# EasyEDA schematic SCH_Nano-2-3s-AM32-ESC_2026-05-21.json
TITLE: Sheet_1; REV: 1.0; Date: 2026-04-12; Sheet: 1/1; Drawn By: minhaz_islam_nafi; Company: Your Company
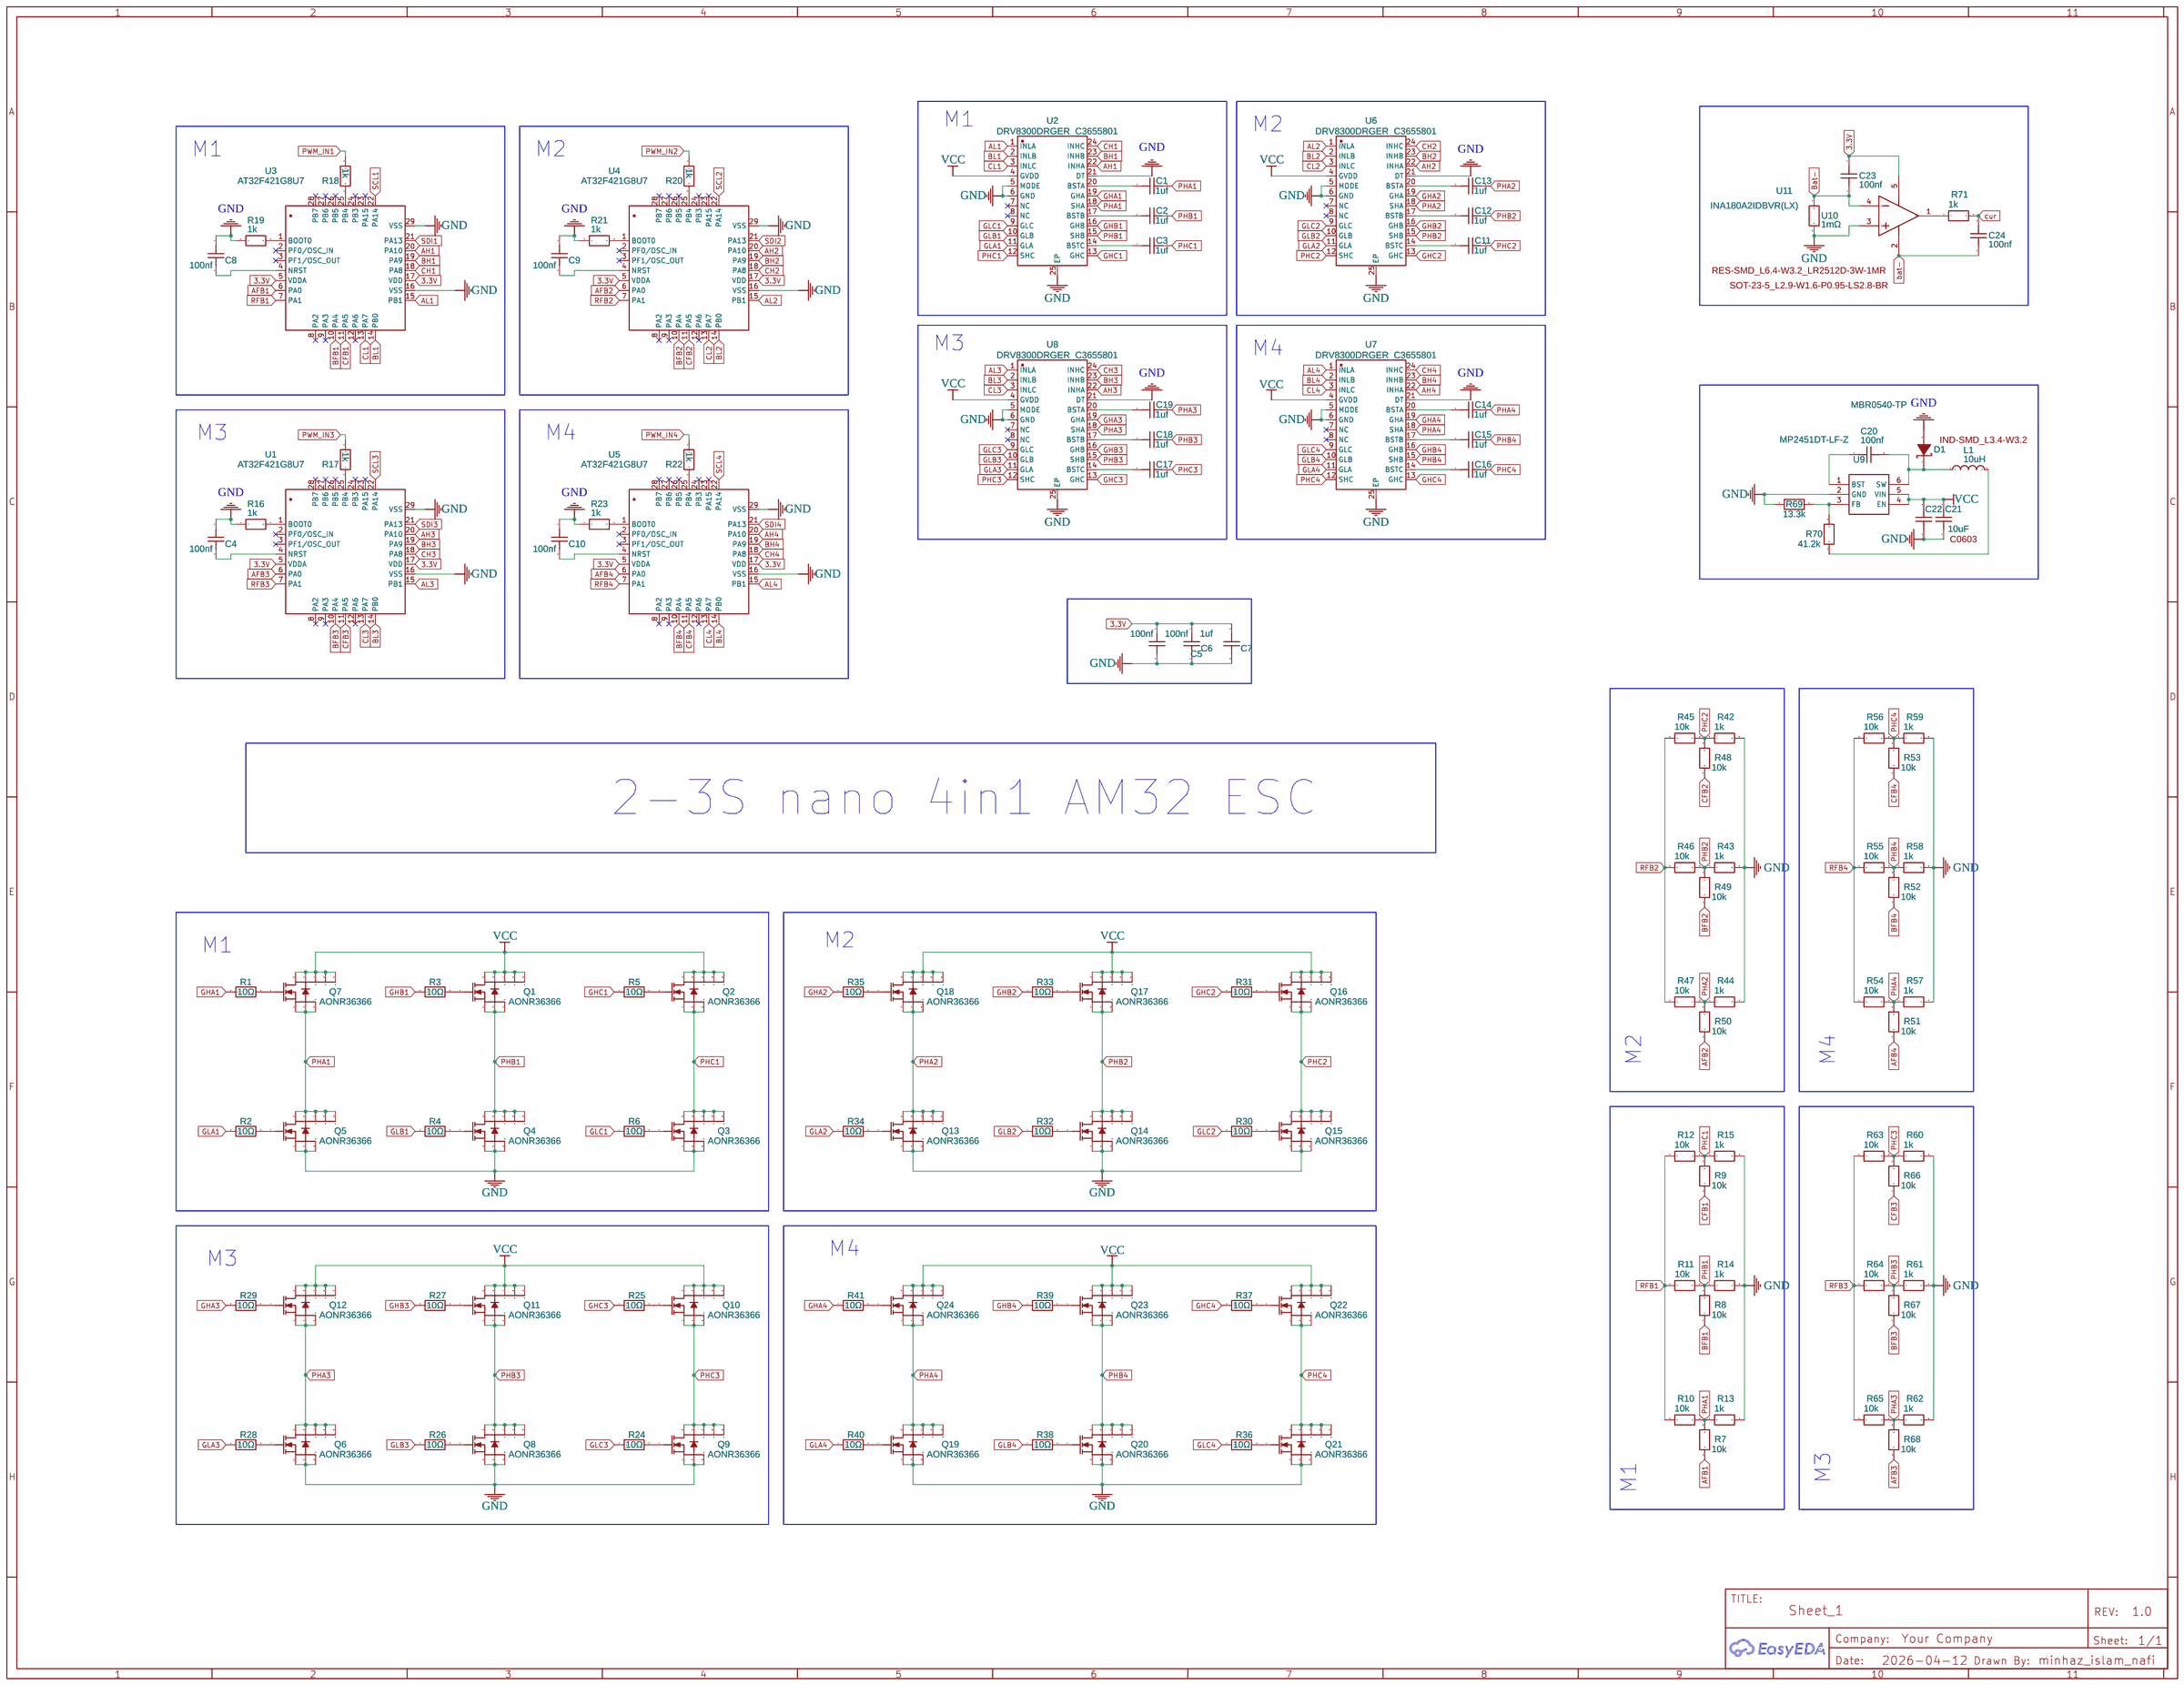
[diagram p0: schematic sheet]

## Parts
C1  1uf  [C0402]
C2  1uf  [C0402]
C3  1uf  [C0402]
C4  100nf  [C0402]
C5  100nf  [C0402]
C6  100nf  [C0402]
C7  1uf  [C0402]
C8  100nf  [C0402]
C9  100nf  [C0402]
C10  100nf  [C0402]
C11  1uf  [C0402]
C12  1uf  [C0402]
C13  1uf  [C0402]
C14  1uf  [C0402]
C15  1uf  [C0402]
C16  1uf  [C0402]
C17  1uf  [C0402]
C18  1uf  [C0402]
C19  1uf  [C0402]
C20  100nf  [C0402]
C21  10uF  [C0603]
C22  10uF  [C0603]
C23  100nf  [C0402]
C24  100nf  [C0402]
D1  MBR0540-TP  [SOD-123_L2.7-W1.6-LS3.7-RD]
L1  10uH  [IND-SMD_L3.4-W3.2]
Q1  AONR36366  [PDFN-8_L3.1-W3.0-P0.65-LS3.3-BL]
Q2  AONR36366  [PDFN-8_L3.1-W3.0-P0.65-LS3.3-BL]
Q3  AONR36366  [PDFN-8_L3.1-W3.0-P0.65-LS3.3-BL]
Q4  AONR36366  [PDFN-8_L3.1-W3.0-P0.65-LS3.3-BL]
Q5  AONR36366  [PDFN-8_L3.1-W3.0-P0.65-LS3.3-BL]
Q6  AONR36366  [PDFN-8_L3.1-W3.0-P0.65-LS3.3-BL]
Q7  AONR36366  [PDFN-8_L3.1-W3.0-P0.65-LS3.3-BL]
Q8  AONR36366  [PDFN-8_L3.1-W3.0-P0.65-LS3.3-BL]
Q9  AONR36366  [PDFN-8_L3.1-W3.0-P0.65-LS3.3-BL]
Q10  AONR36366  [PDFN-8_L3.1-W3.0-P0.65-LS3.3-BL]
Q11  AONR36366  [PDFN-8_L3.1-W3.0-P0.65-LS3.3-BL]
Q12  AONR36366  [PDFN-8_L3.1-W3.0-P0.65-LS3.3-BL]
Q13  AONR36366  [PDFN-8_L3.1-W3.0-P0.65-LS3.3-BL]
Q14  AONR36366  [PDFN-8_L3.1-W3.0-P0.65-LS3.3-BL]
Q15  AONR36366  [PDFN-8_L3.1-W3.0-P0.65-LS3.3-BL]
Q16  AONR36366  [PDFN-8_L3.1-W3.0-P0.65-LS3.3-BL]
Q17  AONR36366  [PDFN-8_L3.1-W3.0-P0.65-LS3.3-BL]
Q18  AONR36366  [PDFN-8_L3.1-W3.0-P0.65-LS3.3-BL]
Q19  AONR36366  [PDFN-8_L3.1-W3.0-P0.65-LS3.3-BL]
Q20  AONR36366  [PDFN-8_L3.1-W3.0-P0.65-LS3.3-BL]
Q21  AONR36366  [PDFN-8_L3.1-W3.0-P0.65-LS3.3-BL]
Q22  AONR36366  [PDFN-8_L3.1-W3.0-P0.65-LS3.3-BL]
Q23  AONR36366  [PDFN-8_L3.1-W3.0-P0.65-LS3.3-BL]
Q24  AONR36366  [PDFN-8_L3.1-W3.0-P0.65-LS3.3-BL]
R1  10Ω  [R0402]
R2  10Ω  [R0402]
R3  10Ω  [R0402]
R4  10Ω  [R0402]
R5  10Ω  [R0402]
R6  10Ω  [R0402]
R7  10k  [R0402]
R8  10k  [R0402]
R9  10k  [R0402]
R10  10k  [R0402]
R11  10k  [R0402]
R12  10k  [R0402]
R13  1k  [R0402]
R14  1k  [R0402]
R15  1k  [R0402]
R16  1k  [R0402]
R17  1k  [R0402]
R18  1k  [R0402]
R19  1k  [R0402]
R20  1k  [R0402]
R21  1k  [R0402]
R22  1k  [R0402]
R23  1k  [R0402]
R24  10Ω  [R0402]
R25  10Ω  [R0402]
R26  10Ω  [R0402]
R27  10Ω  [R0402]
R28  10Ω  [R0402]
R29  10Ω  [R0402]
R30  10Ω  [R0402]
R31  10Ω  [R0402]
R32  10Ω  [R0402]
R33  10Ω  [R0402]
R34  10Ω  [R0402]
R35  10Ω  [R0402]
R36  10Ω  [R0402]
R37  10Ω  [R0402]
R38  10Ω  [R0402]
R39  10Ω  [R0402]
R40  10Ω  [R0402]
R41  10Ω  [R0402]
R42  1k  [R0402]
R43  1k  [R0402]
R44  1k  [R0402]
R45  10k  [R0402]
R46  10k  [R0402]
R47  10k  [R0402]
R48  10k  [R0402]
R49  10k  [R0402]
R50  10k  [R0402]
R51  10k  [R0402]
R52  10k  [R0402]
R53  10k  [R0402]
R54  10k  [R0402]
R55  10k  [R0402]
R56  10k  [R0402]
R57  1k  [R0402]
R58  1k  [R0402]
R59  1k  [R0402]
R60  1k  [R0402]
R61  1k  [R0402]
R62  1k  [R0402]
R63  10k  [R0402]
R64  10k  [R0402]
R65  10k  [R0402]
R66  10k  [R0402]
R67  10k  [R0402]
R68  10k  [R0402]
R69  13.3k  [R0402]
R70  41.2k  [R0402]
R71  1k  [R0402]
U1  AT32F421G8U7  [QFN-28_L4.0-W4.0-P0.40-TL-EP2.4]
U2  DRV8300DRGER_C3655801  [VQFN-24_L4.0-W4.0-P0.50-TL-EP2.5]
U3  AT32F421G8U7  [QFN-28_L4.0-W4.0-P0.40-TL-EP2.4]
U4  AT32F421G8U7  [QFN-28_L4.0-W4.0-P0.40-TL-EP2.4]
U5  AT32F421G8U7  [QFN-28_L4.0-W4.0-P0.40-TL-EP2.4]
U6  DRV8300DRGER_C3655801  [VQFN-24_L4.0-W4.0-P0.50-TL-EP2.5]
U7  DRV8300DRGER_C3655801  [VQFN-24_L4.0-W4.0-P0.50-TL-EP2.5]
U8  DRV8300DRGER_C3655801  [VQFN-24_L4.0-W4.0-P0.50-TL-EP2.5]
U9  MP2451DT-LF-Z  [SOT-23-6_L2.9-W1.6-P0.95-LS2.8-BR]
U10  1mΩ  [RES-SMD_L6.4-W3.2_LR2512D-3W-1MR]
U11  INA180A2IDBVR(LX)  [SOT-23-5_L2.9-W1.6-P0.95-LS2.8-BR]

## Library data of the parts
C1-C20 C23 C24 = C0402C100K8GACTU: Supplier: LCSC; Supplier Part: C28756516; Manufacturer: null; Contributor: lcsc
C21 = FCC0603X106K100CT: Contributor: lcsc; Supplier: LCSC; Supplier Part: C5137565; Manufacturer: FOJAN(富捷); JLCPCB Part Class: Extended Part; Package Display: Yes
C22 = FCC0603X106K100CT: Contributor: lcsc; Supplier: LCSC; Supplier Part: C5137565; Manufacturer: FOJAN(富捷); JLCPCB Part Class: Extended Part; Package Display: No
D1 = MBR0540-TP: Contributor: LCSC; Supplier: LCSC; Supplier Part: C78744; Manufacturer: MCC(美微科); JLCPCB Part Class: Extended Part; Package Display: No
L1 = MDE0320-100M: Contributor: lcsc; Supplier: LCSC; Supplier Part: C2875705; Manufacturer: KOHERelec(科或); JLCPCB Part Class: Extended Part; Package Display: Yes
Q1-Q24 = AONR36366: Contributor: lcsc; Supplier: LCSC; Supplier Part: C541715; Manufacturer: AOS; JLCPCB Part Class: Extended Part
R1-R71 = 0402: Contributor: lcsc; Supplier: LCSC; Supplier Part: C9900015844; Manufacturer: null; JLCPCB Part Class: Extended Part
U1 U3-U5 = AT32F421G8U7: Contributor: LCSC; Supplier: LCSC; Supplier Part: C2765098; Manufacturer: ARTERY(雅特力); JLCPCB Part Class: Extended Part
U2 U6-U8 = DRV8300DRGER_C3655801: Contributor: lcsc; Supplier: LCSC; Supplier Part: C3655801; Manufacturer: TI(德州仪器); Manufacturer Part: DRV8300DRGER; JLCPCB Part Class: Extended Part
U9 = MP2451DT-LF-Z: Supplier: LCSC; Manufacturer: MPS(芯源); Supplier Part: C14123; JLCPCB Part Class: Extended Part; Package Display: No
U10 = PA2512FKF7W0R001E: Supplier: LCSC; Supplier Part: C412505; Manufacturer: YAGEO(国巨); JLCPCB Part Class: Extended Part; Contributor: lcsc; Package Display: Yes
U11 = INA180A2IDBVR(LX): Supplier: LCSC; Supplier Part: C48533471; Manufacturer: LX(灵星芯微); JLCPCB Part Class: Extended Part; Contributor: lcsc; Package Display: Yes

## Nets
3.3V: C5.1 C6.1 C7.1 C23.2 U1.5(VDDA) U1.17(VDD) U3.5(VDDA) U3.17(VDD) U4.5(VDDA) U4.17(VDD) U5.5(VDDA) U5.17(VDD) U11.5(VS)
GND: C4.1 C5.2 C6.2 C7.2 C8.1 C9.1 C10.1 C21.1 C22.1 D1.2(A) Q3.1(S) Q3.2(S) Q3.3(S) Q4.1(S) Q4.2(S) Q4.3(S) Q5.1(S) Q5.2(S) Q5.3(S) Q6.1(S) Q6.2(S) Q6.3(S) Q8.1(S) Q8.2(S) Q8.3(S) Q9.1(S) Q9.2(S) Q9.3(S) Q13.1(S) Q13.2(S) Q13.3(S) Q14.1(S) Q14.2(S) Q14.3(S) Q15.1(S) Q15.2(S) Q15.3(S) Q19.1(S) Q19.2(S) Q19.3(S) Q20.1(S) Q20.2(S) Q20.3(S) Q21.1(S) Q21.2(S) Q21.3(S) R13.2 R14.2 R15.2 R16.1 R19.1 R21.1 R23.1 R42.2 R43.2 R44.2 R57.2 R58.2 R59.2 R60.2 R61.2 R62.2 R69.2 U1.16(VSS) U1.29(VSS) U2.5(MODE) U2.6(GND) U2.21(DT) U2.25(EP) U3.16(VSS) U3.29(VSS) U4.16(VSS) U4.29(VSS) U5.16(VSS) U5.29(VSS) U6.5(MODE) U6.6(GND) U6.21(DT) U6.25(EP) U7.5(MODE) U7.6(GND) U7.21(DT) U7.25(EP) U8.5(MODE) U8.6(GND) U8.21(DT) U8.25(EP) U9.2(GND) U10.2 U11.3(IN+)
VCC: C21.2 C22.2 Q1.5(D) Q1.6(D) Q1.7(D) Q1.8(D) Q1.9(D) Q2.5(D) Q2.6(D) Q2.7(D) Q2.8(D) Q2.9(D) Q7.5(D) Q7.6(D) Q7.7(D) Q7.8(D) Q7.9(D) Q10.5(D) Q10.6(D) Q10.7(D) Q10.8(D) Q10.9(D) Q11.5(D) Q11.6(D) Q11.7(D) Q11.8(D) Q11.9(D) Q12.5(D) Q12.6(D) Q12.7(D) Q12.8(D) Q12.9(D) Q16.5(D) Q16.6(D) Q16.7(D) Q16.8(D) Q16.9(D) Q17.5(D) Q17.6(D) Q17.7(D) Q17.8(D) Q17.9(D) Q18.5(D) Q18.6(D) Q18.7(D) Q18.8(D) Q18.9(D) Q22.5(D) Q22.6(D) Q22.7(D) Q22.8(D) Q22.9(D) Q23.5(D) Q23.6(D) Q23.7(D) Q23.8(D) Q23.9(D) Q24.5(D) Q24.6(D) Q24.7(D) Q24.8(D) Q24.9(D) U2.4(GVDD) U6.4(GVDD) U7.4(GVDD) U8.4(GVDD) U9.4(EN) U9.5(VIN)
AFB1: R7.1 U3.6(PA0)
AFB2: R50.1 U4.6(PA0)
AFB3: R68.1 U1.6(PA0)
AFB4: R51.1 U5.6(PA0)
AH1: U2.22(INHA) U3.20(PA10)
AH2: U4.20(PA10) U6.22(INHA)
AH3: U1.20(PA10) U8.22(INHA)
AH4: U5.20(PA10) U7.22(INHA)
AL1: U2.1(INLA) U3.15(PB1)
AL2: U4.15(PB1) U6.1(INLA)
AL3: U1.15(PB1) U8.1(INLA)
AL4: U5.15(PB1) U7.1(INLA)
Bat-: C23.1 U10.1 U11.4(IN-)
bat-: C24.1 U11.2(GND)
BFB1: R8.1 U3.10(PA4)
BFB2: R49.1 U4.10(PA4)
BFB3: R67.1 U1.10(PA4)
BFB4: R52.1 U5.10(PA4)
BH1: U2.23(INHB) U3.19(PA9)
BH2: U4.19(PA9) U6.23(INHB)
BH3: U1.19(PA9) U8.23(INHB)
BH4: U5.19(PA9) U7.23(INHB)
BL1: U2.2(INLB) U3.14(PB0)
BL2: U4.14(PB0) U6.2(INLB)
BL3: U1.14(PB0) U8.2(INLB)
BL4: U5.14(PB0) U7.2(INLB)
CFB1: R9.1 U3.11(PA5)
CFB2: R48.1 U4.11(PA5)
CFB3: R66.1 U1.11(PA5)
CFB4: R53.1 U5.11(PA5)
CH1: U2.24(INHC) U3.18(PA8)
CH2: U4.18(PA8) U6.24(INHC)
CH3: U1.18(PA8) U8.24(INHC)
CH4: U5.18(PA8) U7.24(INHC)
CL1: U2.3(INLC) U3.13(PA7)
CL2: U4.13(PA7) U6.3(INLC)
CL3: U1.13(PA7) U8.3(INLC)
CL4: U5.13(PA7) U7.3(INLC)
cur: C24.2 R71.2
GHA1: R1.1 U2.19(GHA)
GHA2: R35.1 U6.19(GHA)
GHA3: R29.1 U8.19(GHA)
GHA4: R41.1 U7.19(GHA)
GHB1: R3.1 U2.16(GHB)
GHB2: R33.1 U6.16(GHB)
GHB3: R27.1 U8.16(GHB)
GHB4: R39.1 U7.16(GHB)
GHC1: R5.1 U2.13(GHC)
GHC2: R31.1 U6.13(GHC)
GHC3: R25.1 U8.13(GHC)
GHC4: R37.1 U7.13(GHC)
GLA1: R2.1 U2.11(GLA)
GLA2: R34.1 U6.11(GLA)
GLA3: R28.1 U8.11(GLA)
GLA4: R40.1 U7.11(GLA)
GLB1: R4.1 U2.10(GLB)
GLB2: R32.1 U6.10(GLB)
GLB3: R26.1 U8.10(GLB)
GLB4: R38.1 U7.10(GLB)
GLC1: R6.1 U2.9(GLC)
GLC2: R30.1 U6.9(GLC)
GLC3: R24.1 U8.9(GLC)
GLC4: R36.1 U7.9(GLC)
PHA1: C1.2 Q5.5(D) Q5.6(D) Q5.7(D) Q5.8(D) Q5.9(D) Q7.1(S) Q7.2(S) Q7.3(S) R7.2 R10.2 R13.1 U2.18(SHA)
PHA2: C13.2 Q13.5(D) Q13.6(D) Q13.7(D) Q13.8(D) Q13.9(D) Q18.1(S) Q18.2(S) Q18.3(S) R44.1 R47.2 R50.2 U6.18(SHA)
PHA3: C19.2 Q6.5(D) Q6.6(D) Q6.7(D) Q6.8(D) Q6.9(D) Q12.1(S) Q12.2(S) Q12.3(S) R62.1 R65.2 R68.2 U8.18(SHA)
PHA4: C14.2 Q19.5(D) Q19.6(D) Q19.7(D) Q19.8(D) Q19.9(D) Q24.1(S) Q24.2(S) Q24.3(S) R51.2 R54.2 R57.1 U7.18(SHA)
PHB1: C2.2 Q1.1(S) Q1.2(S) Q1.3(S) Q4.5(D) Q4.6(D) Q4.7(D) Q4.8(D) Q4.9(D) R8.2 R11.2 R14.1 U2.15(SHB)
PHB2: C12.2 Q14.5(D) Q14.6(D) Q14.7(D) Q14.8(D) Q14.9(D) Q17.1(S) Q17.2(S) Q17.3(S) R43.1 R46.2 R49.2 U6.15(SHB)
PHB3: C18.2 Q8.5(D) Q8.6(D) Q8.7(D) Q8.8(D) Q8.9(D) Q11.1(S) Q11.2(S) Q11.3(S) R61.1 R64.2 R67.2 U8.15(SHB)
PHB4: C15.2 Q20.5(D) Q20.6(D) Q20.7(D) Q20.8(D) Q20.9(D) Q23.1(S) Q23.2(S) Q23.3(S) R52.2 R55.2 R58.1 U7.15(SHB)
PHC1: C3.2 Q2.1(S) Q2.2(S) Q2.3(S) Q3.5(D) Q3.6(D) Q3.7(D) Q3.8(D) Q3.9(D) R9.2 R12.2 R15.1 U2.12(SHC)
PHC2: C11.2 Q15.5(D) Q15.6(D) Q15.7(D) Q15.8(D) Q15.9(D) Q16.1(S) Q16.2(S) Q16.3(S) R42.1 R45.2 R48.2 U6.12(SHC)
PHC3: C17.2 Q9.5(D) Q9.6(D) Q9.7(D) Q9.8(D) Q9.9(D) Q10.1(S) Q10.2(S) Q10.3(S) R60.1 R63.2 R66.2 U8.12(SHC)
PHC4: C16.2 Q21.5(D) Q21.6(D) Q21.7(D) Q21.8(D) Q21.9(D) Q22.1(S) Q22.2(S) Q22.3(S) R53.2 R56.2 R59.1 U7.12(SHC)
PWM_IN1: R18.1
PWM_IN2: R20.1
PWM_IN3: R17.1
PWM_IN4: R22.1
RFB1: R10.1 R11.1 R12.1 U3.7(PA1)
RFB2: R45.1 R46.1 R47.1 U4.7(PA1)
RFB3: R63.1 R64.1 R65.1 U1.7(PA1)
RFB4: R54.1 R55.1 R56.1 U5.7(PA1)
SCL1: U3.22(PA14)
SCL2: U4.22(PA14)
SCL3: U1.22(PA14)
SCL4: U5.22(PA14)
SDI1: U3.21(PA13)
SDI2: U4.21(PA13)
SDI3: U1.21(PA13)
SDI4: U5.21(PA13)
Net-(C1-1): C1.1 U2.20(BSTA)
Net-(C2-1): C2.1 U2.17(BSTB)
Net-(C3-1): C3.1 U2.14(BSTC)
Net-(C4-2): C4.2 U1.4(NRST)
Net-(C8-2): C8.2 U3.4(NRST)
Net-(C9-2): C9.2 U4.4(NRST)
Net-(C10-2): C10.2 U5.4(NRST)
Net-(C11-1): C11.1 U6.14(BSTC)
Net-(C12-1): C12.1 U6.17(BSTB)
Net-(C13-1): C13.1 U6.20(BSTA)
Net-(C14-1): C14.1 U7.20(BSTA)
Net-(C15-1): C15.1 U7.17(BSTB)
Net-(C16-1): C16.1 U7.14(BSTC)
Net-(C17-1): C17.1 U8.14(BSTC)
Net-(C18-1): C18.1 U8.17(BSTB)
Net-(C19-1): C19.1 U8.20(BSTA)
Net-(C20-1): C20.1 U9.1(BST)
Net-(C20-2): C20.2 D1.1(K) L1.1 U9.6(SW)
Net-(L1-2): L1.2 R70.1
Net-(Q1-4): Q1.4(G) R3.2
Net-(Q2-4): Q2.4(G) R5.2
Net-(Q3-4): Q3.4(G) R6.2
Net-(Q4-4): Q4.4(G) R4.2
Net-(Q5-4): Q5.4(G) R2.2
Net-(Q6-4): Q6.4(G) R28.2
Net-(Q7-4): Q7.4(G) R1.2
Net-(Q8-4): Q8.4(G) R26.2
Net-(Q9-4): Q9.4(G) R24.2
Net-(Q10-4): Q10.4(G) R25.2
Net-(Q11-4): Q11.4(G) R27.2
Net-(Q12-4): Q12.4(G) R29.2
Net-(Q13-4): Q13.4(G) R34.2
Net-(Q14-4): Q14.4(G) R32.2
Net-(Q15-4): Q15.4(G) R30.2
Net-(Q16-4): Q16.4(G) R31.2
Net-(Q17-4): Q17.4(G) R33.2
Net-(Q18-4): Q18.4(G) R35.2
Net-(Q19-4): Q19.4(G) R40.2
Net-(Q20-4): Q20.4(G) R38.2
Net-(Q21-4): Q21.4(G) R36.2
Net-(Q22-4): Q22.4(G) R37.2
Net-(Q23-4): Q23.4(G) R39.2
Net-(Q24-4): Q24.4(G) R41.2
Net-(R16-2): R16.2 U1.1(BOOT0)
Net-(R17-2): R17.2 U1.25(PB4)
Net-(R18-2): R18.2 U3.25(PB4)
Net-(R19-2): R19.2 U3.1(BOOT0)
Net-(R20-2): R20.2 U4.25(PB4)
Net-(R21-2): R21.2 U4.1(BOOT0)
Net-(R22-2): R22.2 U5.25(PB4)
Net-(R23-2): R23.2 U5.1(BOOT0)
Net-(R69-1): R69.1 R70.2 U9.3(FB)
Net-(R71-1): R71.1 U11.1(OUT)

Not connected (* = marked no-connect by the designer): U1 2(PF0/OSC_IN)* 3(PF1/OSC_OUT)* 8(PA2)* 9(PA3)* 12(PA6)* 23(PA15)* 24(PB3)* 26(PB5)* 27(PB6)* 28(PB7)*; U2 7(NC)* 8(NC)*; U3 2(PF0/OSC_IN)* 3(PF1/OSC_OUT)* 8(PA2)* 9(PA3)* 12(PA6)* 23(PA15)* 24(PB3)* 26(PB5)* 27(PB6)* 28(PB7)*; U4 2(PF0/OSC_IN)* 3(PF1/OSC_OUT)* 8(PA2)* 9(PA3)* 12(PA6)* 23(PA15)* 24(PB3)* 26(PB5)* 27(PB6)* 28(PB7)*; U5 2(PF0/OSC_IN)* 3(PF1/OSC_OUT)* 8(PA2)* 9(PA3)* 12(PA6)* 23(PA15)* 24(PB3)* 26(PB5)* 27(PB6)* 28(PB7)*; U6 7(NC)* 8(NC)*; U7 7(NC)* 8(NC)*; U8 7(NC)* 8(NC)*

## Notes on the sheet
- M1
- M2
- M1
- M2
- M3
- M4
- M3
- M4
- 2-3S nano 4in1 AM32 ESC
- M1
- M2
- M2
- M4
- M4
- M3
- M3
- M1
